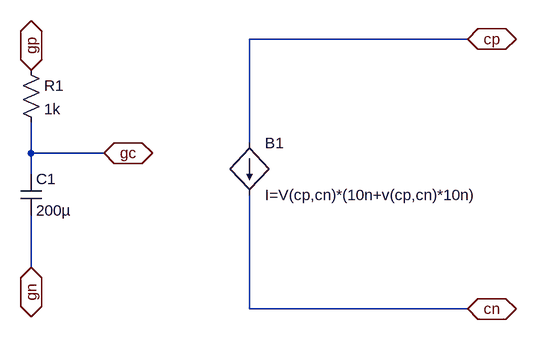
[diagram p0: schematic le_gros_capteur.asc]
le_gros_capteur.asc, the LTspice schematic file:
Version 4
SHEET 1 880 680
WIRE 768 -16 432 -16
WIRE 432 144 432 -16
WIRE 96 160 96 112
WIRE 208 160 96 160
WIRE 96 192 96 160
WIRE 96 336 96 256
WIRE 432 400 432 224
WIRE 768 400 432 400
FLAG 208 160 gc
IOPIN 208 160 BiDir
FLAG 96 32 gp
IOPIN 96 32 BiDir
FLAG 96 336 gn
IOPIN 96 336 BiDir
FLAG 768 -16 cp
IOPIN 768 -16 BiDir
FLAG 768 400 cn
IOPIN 768 400 BiDir
SYMBOL res 80 16 R0
SYMATTR InstName R1
SYMATTR Value 1k
SYMBOL cap 80 192 R0
SYMATTR InstName C1
SYMATTR Value 200µ
SYMBOL bi 432 144 R0
SYMATTR InstName B1
SYMATTR Value I=V(cp,cn)*(10n+v(cp,cn)*10n)

The netlist it stands for:
* le_gros_capteur.asc
R1 gp gc 1k
C1 gc gn 200µ
B1 cp cn I=V(cp,cn)*(10n+v(cp,cn)*10n)
.backanno
.end